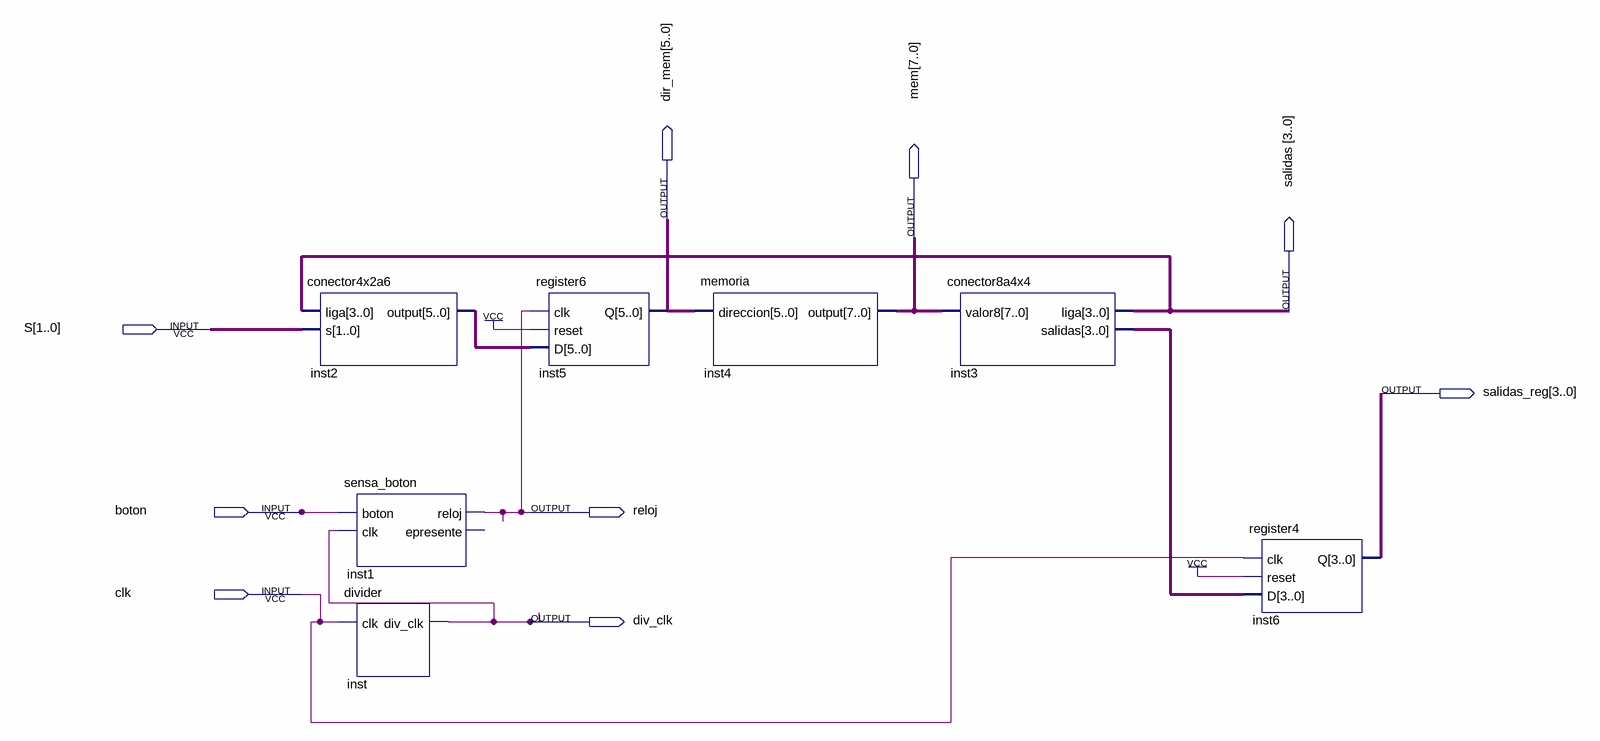
[diagram p0: schematic sheet]
// Quartus schematic practica3.bdf as structural Verilog: 7 symbols, 9 pins
module practica3 (
  input  [1:0] S,
  input  boton,
  input  clk,
  output [5:0] dir_mem,
  output [7:0] mem,
  output [3:0] salidas,
  output [3:0] salidas_reg,
  output reloj,
  output div_clk
);

  wire [3:0] inst3_salidas;
  wire [5:0] inst2_output;

  conector4x2a6 inst2 (.liga(salidas), .s(S), .\output (inst2_output));
  sensa_boton inst1 (.boton(boton), .clk(div_clk), .reloj(reloj));  // open: epresente
  divider inst (.clk(clk), .div_clk(div_clk));
  register6 inst5 (.clk(reloj), .reset(1'b1), .D(inst2_output), .Q(dir_mem));
  memoria inst4 (.direccion(dir_mem), .\output (mem));
  conector8a4x4 inst3 (.valor8(mem), .liga(salidas), .salidas(inst3_salidas));
  register4 inst6 (.clk(clk), .reset(1'b1), .D(inst3_salidas), .Q(salidas_reg));
endmodule
